# EAGLE design Temp (EAGLE 7.2.0)
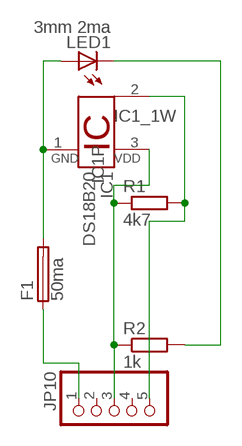
[diagram p0: schematic, sheet 1]

## Parts
F1  50ma  MF-SMDF050  [MF-SMDF050]
IC1  DS18B20  [TO92-]
JP10  PINHD-1X5  [1X05]
LED1  3mm 2ma  TLLY4400  [LED3MM]
R1  4k7  R-EU_R1206  [R1206]
R2  1k  R-EU_R1206  [R1206]

## Nets
N$1: F1.2 IC1.1 LED1.A
N$2: LED1.K(C) R2.2
N$3: IC1.2 JP10.5 R1.2
N$14: IC1.3 JP10.3 R1.1 R2.1
N$15: F1.1 JP10.1
Unconnected: JP10.2 JP10.4

## Library data of the parts
F1 = fuse:MF-SMDF: MF-SMDF Series - PRC Resettable Fuses Source: http://www.farnell.com/datasheets/716597.pdf
IC1 = 1wire:DS18B20: Programmable Resolution Digital Thermometer This chip provides a onewire thermosensor with approx. 0.5°C accuracy. A programmable over/undertemperure alarm is available. The precision can be set from 9..12 bits. Notes: Vdd must be applied for accurate measurements at low temperatures, as the parasite power circuit otherwise heats the sensor. If parasite power is used, Vdd has to be connected to GND. The DS1822 is a low-cost thermometer chip, the DS18S20 is similar to the DS18B20, but with 9 Bit precision only. Author: Jan Kandziora <jjj@gmx.de>
JP10 = pinhead:PINHD-1X5: PIN HEADER
LED1 = led:TLLY4400: Low Current (2mA) LED 3 mm Tinted Diffused Package color YELLOW Source: Data sheet <http://www.farnell.com/datasheets/391098.pdf>; MF: VISHAY SEMICONDUCTOR; OC_FARNELL: 1612439
R1 R2 = rcl:R-EU_: RESISTOR, European symbol

## Board
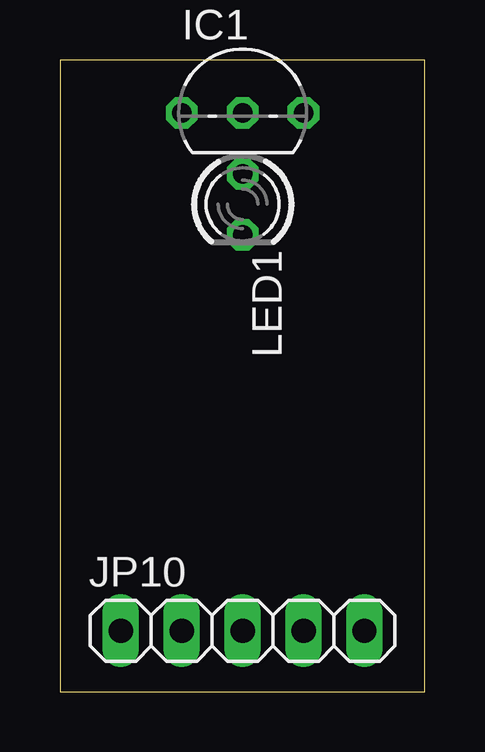
[diagram p1: board, top side]
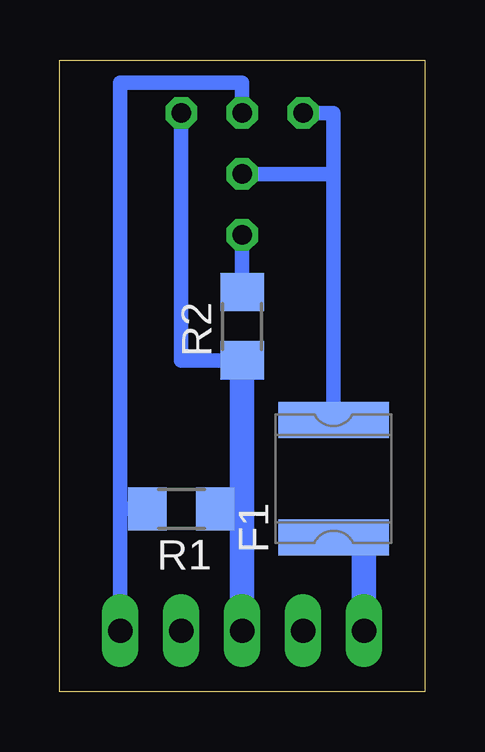
[diagram p2: board, bottom side, seen from below]

Size 15.22 x 26.34 mm. Coordinates in mm from the lower left corner, seen from the top.
Outline: 0,0 15.22,0 15.22,26.34 0,26.34 0,0
Copper layers (1*16): Top 0.035mm / dielectric 1.5mm / Bottom 0.035mm
Design rules "default": minimum track width 10mil, minimum drill 24mil, track to track 8mil, track to pad 8mil, pad to pad 8mil, via to via 8mil, smd to smd 8mil, copper to edge 40mil, drill to drill 8mil, minimum pad ring 10mil, minimum via ring 8mil, stop-mask expansion 4mil, vias tented up to drill 0mil, thermal gap 10mil

### Footprints (pad centres in the part's own frame; a part is rotated, then mirrored left to right if it is on the bottom)
MF-SMDF050 = smd 1.5 x 4.6: 1 -2.45,0; 2 2.45,0
TO92- = drill 0.813 octagon: 1 -2.54,0; 2 0,0; 3 2.54,0
1X05 = drill 1.016 long: 1 -5.08,0; 2 -2.54,0; 3 0,0; 4 2.54,0; 5 5.08,0
LED3MM = drill 0.813 octagon: A -1.27,0; K 1.27,0
R1206 = smd 1.6 x 1.803: 1 -1.422,0; 2 1.422,0

### Placement (x,y rotation side)
F1  3.81,8.89 90 bottom
IC1  7.62,24.13 0 top
JP10  7.62,2.54 0 top
LED1  7.62,20.32 270 top
R1  10.16,7.62 180 bottom
R2  7.62,15.24 90 bottom

### Tracks (layer width: path | path; a pad name or v marks a point on that pad's centre or on a via)
N$1
  Bottom 0.61: F1.2 3.81,21.59 | 3.81,21.59 3.81,24.13 IC1.1 | LED1.A 3.81,21.59
N$2
  Bottom 0.61: R2.2 LED1.K
N$3
  Bottom 0.61: JP10.5 12.7,7.62 | 12.7,7.62 12.7,25.4 7.62,25.4 IC1.2 | R1.2 12.7,7.62
N$14
  Bottom 0.61: IC1.3 10.16,13.82 R2.1 | R1.1 7.62,7.62 JP10.3
  Bottom 1.016: R2.1 JP10.3
N$15
  Bottom 1.016: F1.1 2.54,6.44 JP10.1